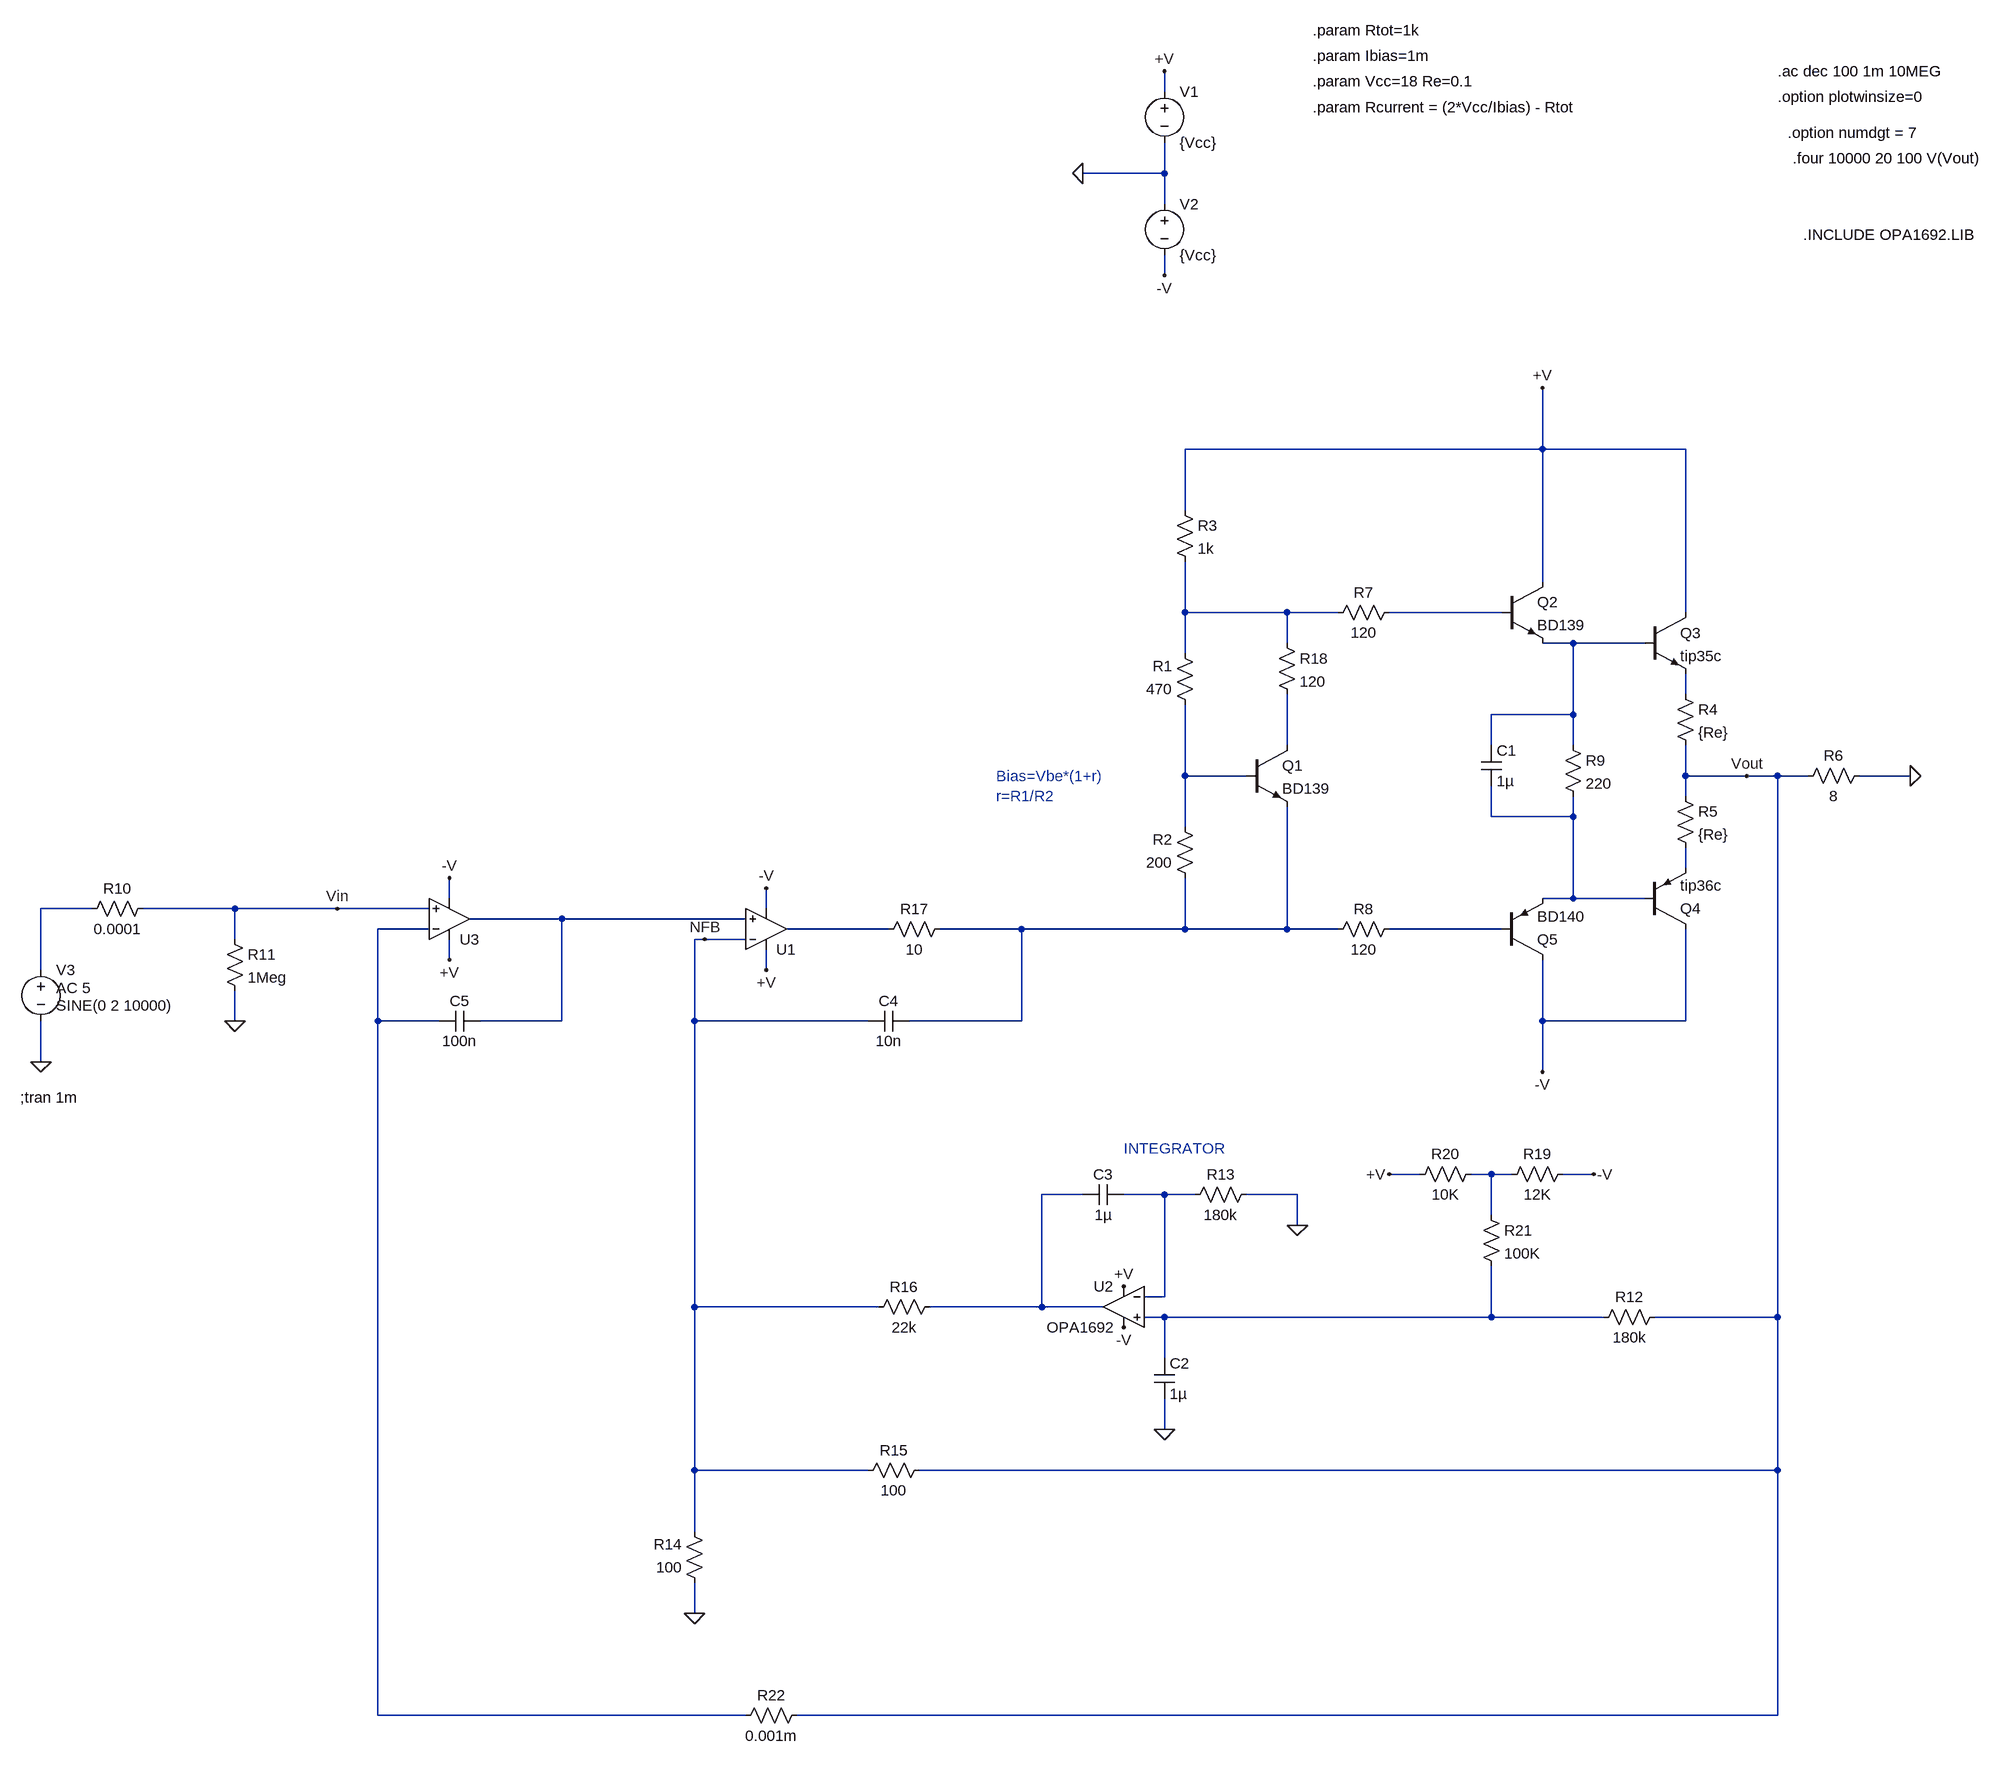
[diagram p0: schematic AC.asc]
AC.asc, the LTspice schematic file:
Version 4
SHEET 1 1224 1604
WIRE -80 -1136 -80 -1168
WIRE -80 -1008 -80 -1056
WIRE -80 -1008 -208 -1008
WIRE -80 -960 -80 -1008
WIRE -80 -848 -80 -880
WIRE 512 -576 512 -672
WIRE 512 -576 -48 -576
WIRE 736 -576 512 -576
WIRE -48 -480 -48 -576
WIRE 512 -368 512 -576
WIRE -48 -320 -48 -400
WIRE 112 -320 -48 -320
WIRE 192 -320 112 -320
WIRE 448 -320 272 -320
WIRE 736 -320 736 -576
WIRE 112 -272 112 -320
WIRE 560 -272 512 -272
WIRE 672 -272 560 -272
WIRE -48 -256 -48 -320
WIRE 736 -192 736 -224
WIRE 560 -160 560 -272
WIRE 560 -160 432 -160
WIRE 112 -112 112 -192
WIRE 432 -112 432 -160
WIRE 560 -112 560 -160
WIRE -48 -64 -48 -176
WIRE 48 -64 -48 -64
WIRE 736 -64 736 -112
WIRE 832 -64 736 -64
WIRE 880 -64 832 -64
WIRE 928 -64 880 -64
WIRE 1088 -64 1008 -64
WIRE 736 -32 736 -64
WIRE 432 0 432 -48
WIRE 560 0 560 -32
WIRE 560 0 432 0
WIRE -48 16 -48 -64
WIRE 736 80 736 48
WIRE -1200 128 -1200 96
WIRE 560 128 560 0
WIRE 560 128 512 128
WIRE 672 128 560 128
WIRE -1760 144 -1840 144
WIRE -1536 144 -1680 144
WIRE -1376 144 -1536 144
WIRE -1232 144 -1376 144
WIRE -704 144 -704 112
WIRE -1024 160 -1168 160
WIRE -736 160 -1024 160
WIRE -1232 176 -1312 176
WIRE -512 176 -672 176
WIRE -304 176 -432 176
WIRE -48 176 -48 96
WIRE -48 176 -304 176
WIRE 112 176 112 -16
WIRE 112 176 -48 176
WIRE 192 176 112 176
WIRE 448 176 272 176
WIRE -1536 192 -1536 144
WIRE -800 192 -816 192
WIRE -736 192 -800 192
WIRE -1200 224 -1200 192
WIRE -1840 240 -1840 144
WIRE -704 240 -704 208
WIRE -1536 320 -1536 272
WIRE -1312 320 -1312 176
WIRE -1216 320 -1312 320
WIRE -1024 320 -1024 160
WIRE -1024 320 -1152 320
WIRE -816 320 -816 192
WIRE -544 320 -816 320
WIRE -304 320 -304 176
WIRE -304 320 -480 320
WIRE 512 320 512 224
WIRE 736 320 736 176
WIRE 736 320 512 320
WIRE -1840 384 -1840 320
WIRE 512 400 512 320
WIRE 320 560 272 560
WIRE 432 560 400 560
WIRE 464 560 432 560
WIRE 592 560 544 560
WIRE -208 592 -272 592
WIRE -80 592 -144 592
WIRE -32 592 -80 592
WIRE 128 592 48 592
WIRE 432 624 432 560
WIRE 128 640 128 592
WIRE -80 752 -80 592
WIRE -80 752 -112 752
WIRE -816 768 -816 320
WIRE -528 768 -816 768
WIRE -272 768 -272 592
WIRE -272 768 -448 768
WIRE -176 768 -272 768
WIRE -80 784 -112 784
WIRE 432 784 432 704
WIRE 432 784 -80 784
WIRE 608 784 432 784
WIRE 880 784 880 -64
WIRE 880 784 688 784
WIRE -80 848 -80 784
WIRE -80 960 -80 912
WIRE -816 1024 -816 768
WIRE -544 1024 -816 1024
WIRE 880 1024 880 784
WIRE 880 1024 -464 1024
WIRE -816 1120 -816 1024
WIRE -816 1248 -816 1200
WIRE -1312 1408 -1312 320
WIRE -736 1408 -1312 1408
WIRE 880 1408 880 1024
WIRE 880 1408 -656 1408
FLAG 512 -672 +V
FLAG 512 400 -V
FLAG -208 -1008 0
FLAG -80 -1168 +V
FLAG -80 -848 -V
FLAG 1088 -64 0
FLAG 832 -64 Vout
FLAG -1840 384 0
FLAG -704 240 +V
FLAG -704 112 -V
FLAG -1536 320 0
FLAG -144 736 +V
FLAG -144 800 -V
FLAG -80 960 0
FLAG 128 640 0
FLAG -800 192 NFB
FLAG -816 1248 0
FLAG 272 560 +V
FLAG 592 560 -V
FLAG -1200 224 +V
FLAG -1200 96 -V
FLAG -1376 144 Vin
SYMBOL res -32 -160 R180
WINDOW 0 36 76 Left 2
WINDOW 3 36 40 Left 2
SYMATTR InstName R1
SYMATTR Value 470
SYMBOL res -32 112 R180
WINDOW 0 36 76 Left 2
WINDOW 3 36 40 Left 2
SYMATTR InstName R2
SYMATTR Value 200
SYMBOL npn 48 -112 R0
SYMATTR InstName Q1
SYMATTR Value BD139
SYMBOL npn 448 -368 R0
SYMATTR InstName Q2
SYMATTR Value BD139
SYMBOL npn 672 -320 R0
SYMATTR InstName Q3
SYMATTR Value tip35c
SYMBOL res -64 -496 R0
SYMATTR InstName R3
SYMATTR Value 1k
SYMBOL pnp 672 176 M180
SYMATTR InstName Q4
SYMATTR Value tip36c
SYMBOL pnp 448 224 M180
SYMATTR InstName Q5
SYMATTR Value BD140
SYMBOL res 720 -208 R0
SYMATTR InstName R4
SYMATTR Value {Re}
SYMBOL res 720 -48 R0
SYMATTR InstName R5
SYMATTR Value {Re}
SYMBOL voltage -80 -1152 R0
WINDOW 123 0 0 Left 0
WINDOW 39 0 0 Left 0
SYMATTR InstName V1
SYMATTR Value {Vcc}
SYMBOL voltage -80 -976 R0
WINDOW 123 0 0 Left 0
WINDOW 39 0 0 Left 0
SYMATTR InstName V2
SYMATTR Value {Vcc}
SYMBOL res 1024 -80 R90
WINDOW 0 0 56 VBottom 2
WINDOW 3 32 56 VTop 2
SYMATTR InstName R6
SYMATTR Value 8
SYMBOL res 288 -336 R90
WINDOW 0 0 56 VBottom 2
WINDOW 3 32 56 VTop 2
SYMATTR InstName R7
SYMATTR Value 120
SYMBOL res 288 160 R90
WINDOW 0 0 56 VBottom 2
WINDOW 3 32 56 VTop 2
SYMATTR InstName R8
SYMATTR Value 120
SYMBOL res 544 -128 R0
SYMATTR InstName R9
SYMATTR Value 220
SYMBOL cap 416 -112 R0
SYMATTR InstName C1
SYMATTR Value 1µ
SYMBOL OpAmps\\opamp2 -704 240 M180
WINDOW 3 16 96 Invisible 2
SYMATTR Value OPA1692
SYMATTR InstName U1
SYMBOL voltage -1840 224 R0
WINDOW 123 24 44 Left 2
WINDOW 39 0 0 Left 0
WINDOW 3 24 72 Left 2
SYMATTR Value2 AC 5
SYMATTR Value SINE(0 2 10000)
SYMATTR InstName V3
SYMBOL res -1664 128 R90
WINDOW 0 0 56 VBottom 2
WINDOW 3 32 56 VTop 2
SYMATTR InstName R10
SYMATTR Value 0.0001
SYMBOL res -1552 176 R0
SYMATTR InstName R11
SYMATTR Value 1Meg
SYMBOL OpAmps\\opamp2 -144 704 M0
SYMATTR InstName U2
SYMATTR Value OPA1692
SYMBOL res 704 768 R90
WINDOW 0 0 56 VBottom 2
WINDOW 3 32 56 VTop 2
SYMATTR InstName R12
SYMATTR Value 180k
SYMBOL cap -96 848 R0
SYMATTR InstName C2
SYMATTR Value 1µ
SYMBOL cap -144 576 R90
WINDOW 0 0 32 VBottom 2
WINDOW 3 32 32 VTop 2
SYMATTR InstName C3
SYMATTR Value 1µ
SYMBOL res 64 576 R90
WINDOW 0 0 56 VBottom 2
WINDOW 3 32 56 VTop 2
SYMATTR InstName R13
SYMATTR Value 180k
SYMBOL res -800 1216 R180
WINDOW 0 36 76 Left 2
WINDOW 3 36 40 Left 2
SYMATTR InstName R14
SYMATTR Value 100
SYMBOL res -448 1008 R90
WINDOW 0 0 56 VBottom 2
WINDOW 3 32 56 VTop 2
SYMATTR InstName R15
SYMATTR Value 100
SYMBOL res -432 752 R90
WINDOW 0 0 56 VBottom 2
WINDOW 3 32 56 VTop 2
SYMATTR InstName R16
SYMATTR Value 22k
SYMBOL res -416 160 R90
WINDOW 0 0 56 VBottom 2
WINDOW 3 32 56 VTop 2
SYMATTR InstName R17
SYMATTR Value 10
SYMBOL res 96 -288 R0
SYMATTR InstName R18
SYMATTR Value 120
SYMBOL res 560 544 R90
WINDOW 0 0 56 VBottom 2
WINDOW 3 32 56 VTop 2
SYMATTR InstName R19
SYMATTR Value 12K
SYMBOL res 416 544 R90
WINDOW 0 0 56 VBottom 2
WINDOW 3 32 56 VTop 2
SYMATTR InstName R20
SYMATTR Value 10K
SYMBOL res 416 608 R0
SYMATTR InstName R21
SYMATTR Value 100K
SYMBOL cap -480 304 R90
WINDOW 0 0 32 VBottom 2
WINDOW 3 32 32 VTop 2
SYMATTR InstName C4
SYMATTR Value 10n
SYMBOL OpAmps\\opamp2 -1200 224 M180
WINDOW 3 16 96 Invisible 2
SYMATTR Value OPA1692
SYMATTR InstName U3
SYMBOL cap -1152 304 R90
WINDOW 0 0 32 VBottom 2
WINDOW 3 32 32 VTop 2
SYMATTR InstName C5
SYMATTR Value 100n
SYMBOL res -640 1392 R90
WINDOW 0 0 56 VBottom 2
WINDOW 3 32 56 VTop 2
SYMATTR InstName R22
SYMATTR Value 0.001m
TEXT -344 -64 Left 2 ;Bias=Vbe*(1+r)\nr=R1/R2
TEXT 152 -1232 Left 2 !.param Rtot=1k
TEXT 152 -1192 Left 2 !.param Ibias=1m
TEXT 152 -1152 Left 2 !.param Vcc=18 Re=0.1
TEXT 152 -1112 Left 2 !.param Rcurrent = (2*Vcc/Ibias) - Rtot
TEXT 880 -1168 Left 2 !.ac dec 100 1m 10MEG
TEXT 880 -1128 Left 2 !.option plotwinsize=0
TEXT 896 -1072 Left 2 !.option numdgt = 7
TEXT 904 -1032 Left 2 !.four 10000 20 100 V(Vout)
TEXT 920 -912 Left 2 !.INCLUDE OPA1692.LIB
TEXT -1872 440 Left 2 !;tran 1m
TEXT -144 520 Left 2 ;INTEGRATOR

The netlist it stands for:
* AC.asc
R1 N006 N001 470
R2 N013 N006 200
Q1 N005 N006 N013 0 BD139
Q2 +V N002 N003 0 BD139
Q3 +V N003 N004 0 tip35c
R3 +V N001 1k
Q4 -V N007 N008 0 tip36c
Q5 -V N014 N007 0 BD140
R4 N004 Vout {Re}
R5 Vout N008 {Re}
V1 +V 0 {Vcc}
V2 0 -V {Vcc}
R6 0 Vout 8
R7 N002 N001 120
R8 N014 N013 120
R9 N003 N007 220
C1 N003 N007 1µ
XU1 N010 NFB +V -V N012 OPA1692  ; pins In+ In- V+ V- OUT
V3 N009 0 SINE(0 2 10000) AC 5
R10 Vin N009 0.0001
R11 Vin 0 1Meg
XU2 N018 N017 +V -V N016 OPA1692  ; pins In+ In- V+ V- OUT
R12 Vout N018 180k
C2 N018 0 1µ
C3 N017 N016 1µ
R13 0 N017 180k
R14 0 NFB 100
R15 Vout NFB 100
R16 N016 NFB 22k
R17 N013 N012 10
R18 N001 N005 120
R19 -V N015 12K
R20 N015 +V 10K
R21 N015 N018 100K
C4 N013 NFB 10n
XU3 Vin N011 +V -V N010 OPA1692  ; pins In+ In- V+ V- OUT
C5 N010 N011 100n
R22 Vout N011 0.001m
.model NPN NPN
.model PNP PNP
.lib standard.bjt
* Bias=Vbe*(1+r)
* r=R1/R2
.param Rtot=1k
.param Ibias=1m
.param Vcc=18 Re=0.1
.param Rcurrent = (2*Vcc/Ibias) - Rtot
.ac dec 100 1m 10MEG
.option plotwinsize=0
.option numdgt = 7
.four 10000 20 100 V(Vout)
.INCLUDE OPA1692.LIB
;tran 1m
* INTEGRATOR
.backanno
.end